# EasyEDA schematic EasyEDA_SCH_alexo_2026-07-04.json
TITLE: Circuito elettrico ALEXO - Assistente vocale; REV: 1.1; Date: 2026-06-28; Sheet: 1/1; Company: Peppe Minniti
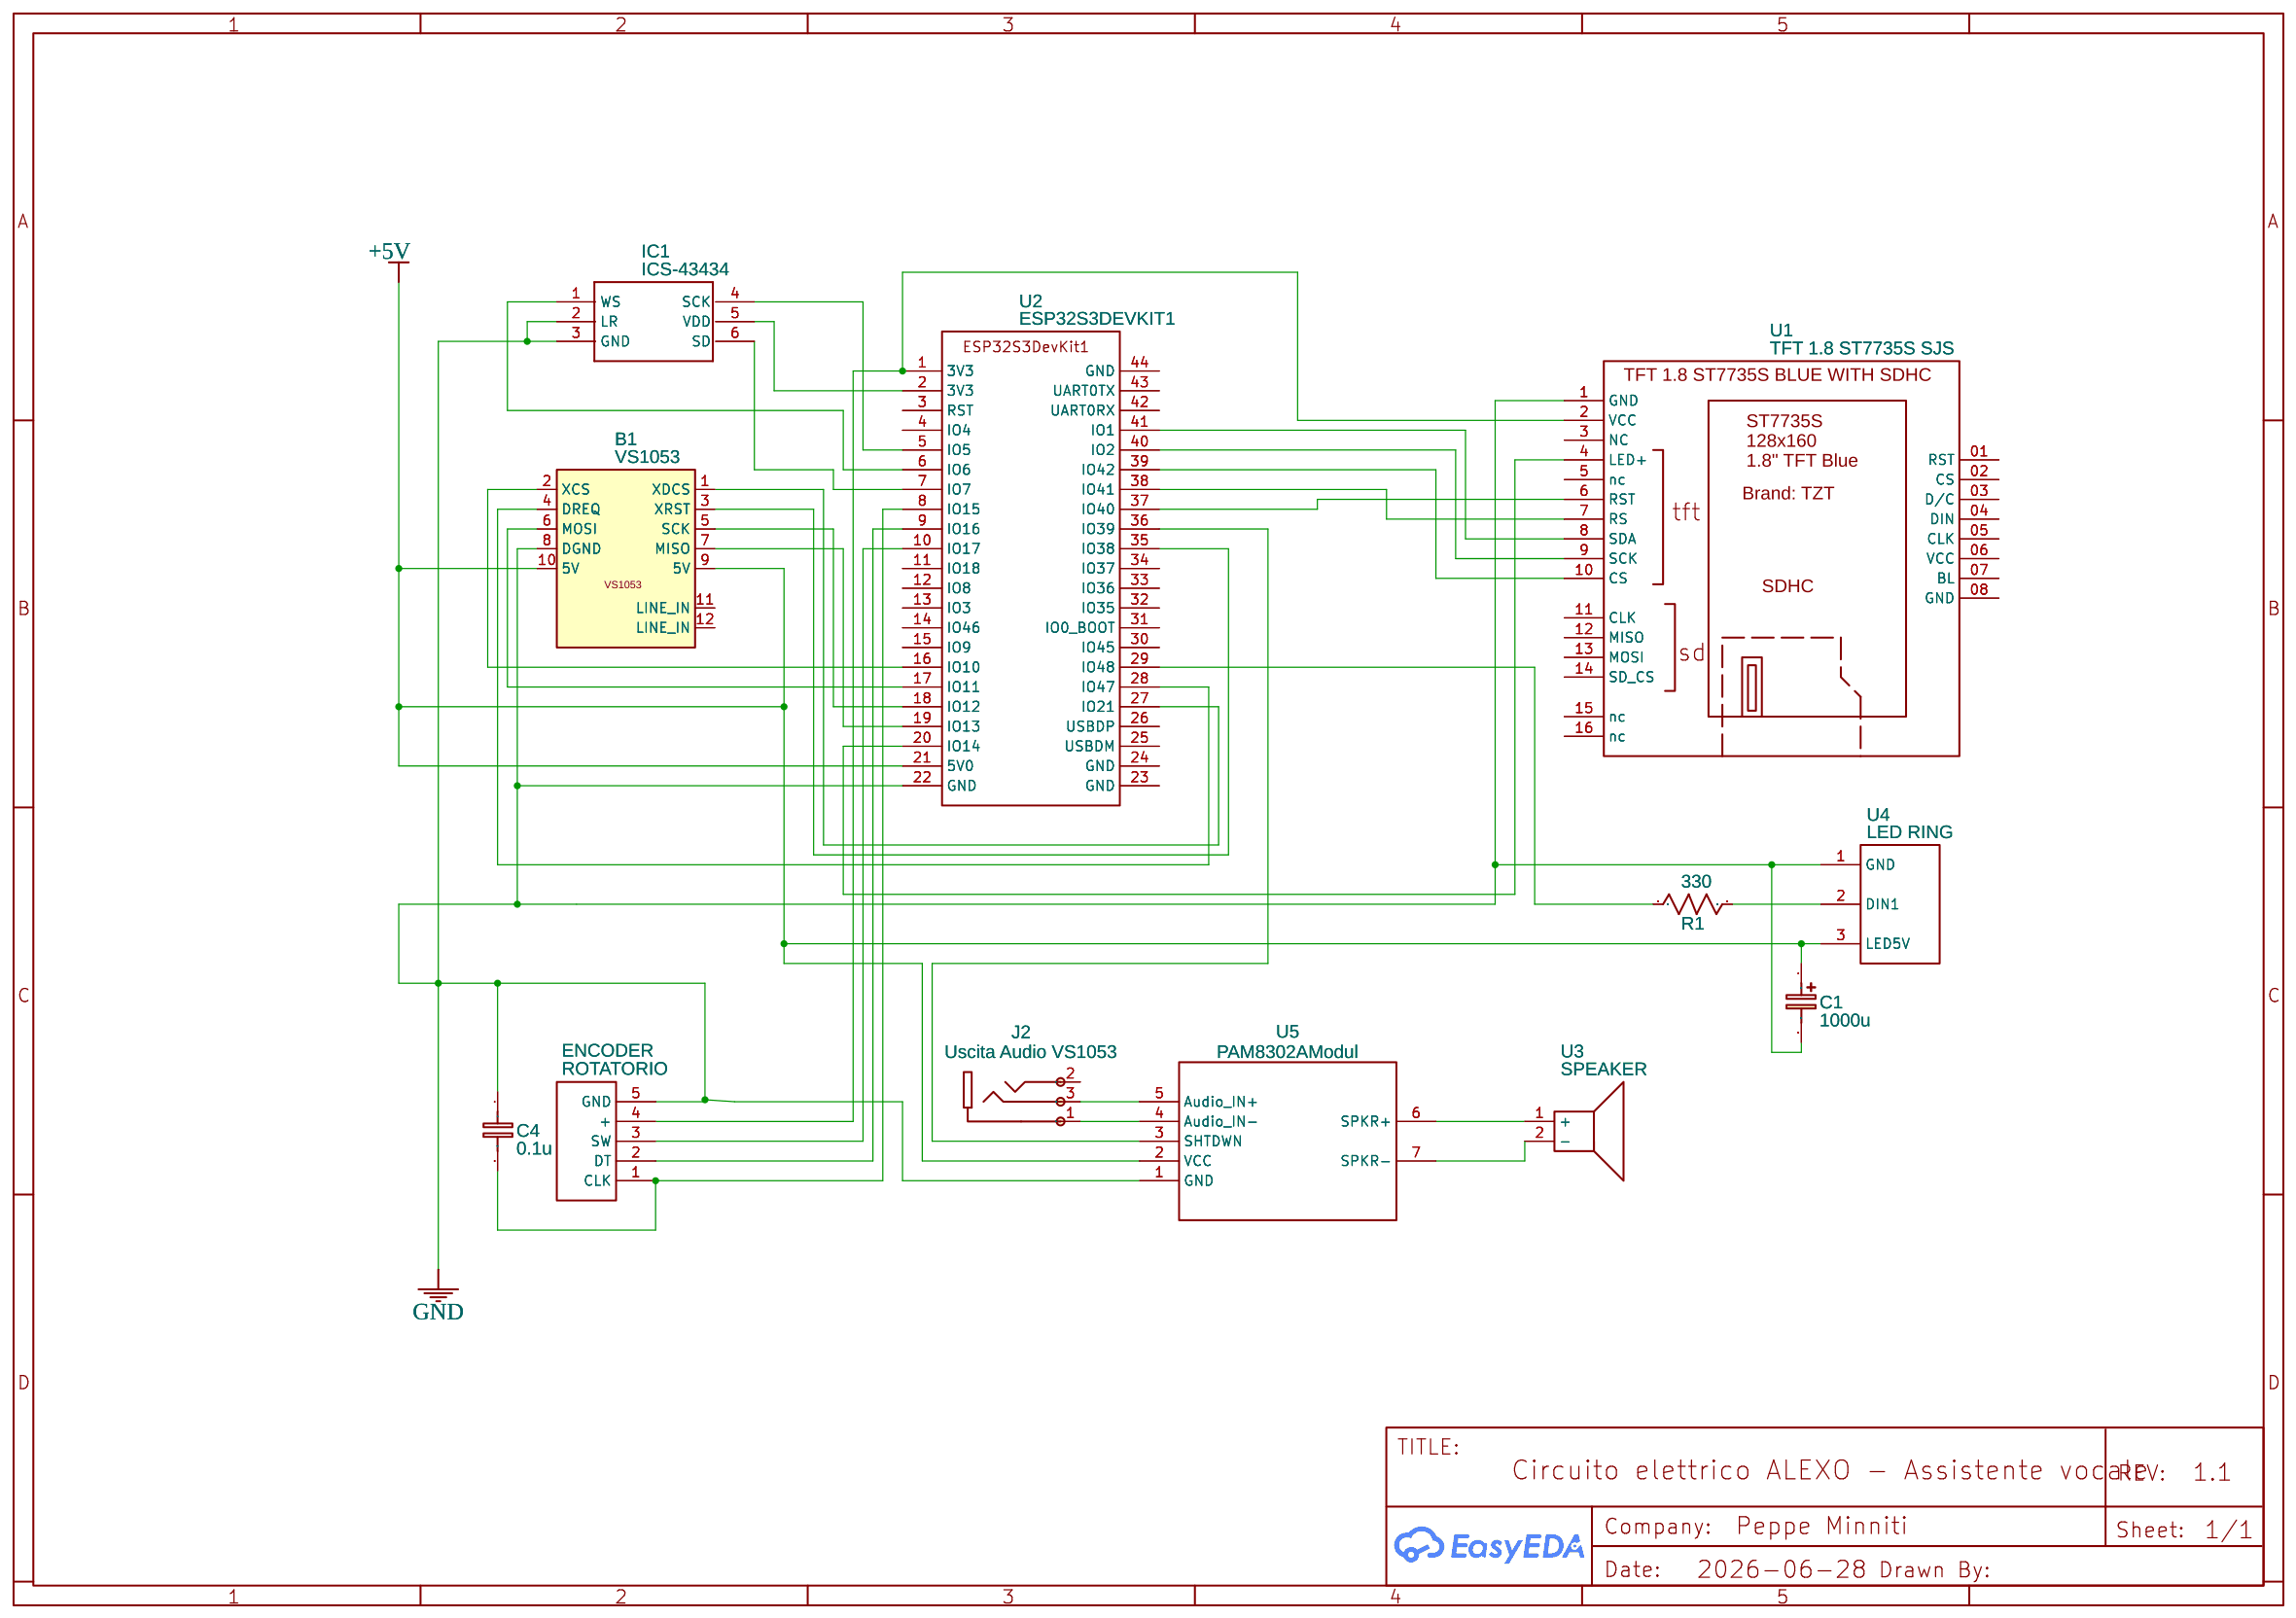
[diagram p0: schematic sheet]

## Parts
B1  VS1053  [VS1053]
C1  1000u  [CASE-A_3216]
C4  0.1u  [C0603]
ENCODER  ROTATORIO  [ROTARYENCODER]
IC1  ICS-43434  [ICS43434]
J2  Uscita Audio VS1053  [AUDIO-SMD_PJ-320B]
R1  330  [R0603]
U1  TFT 1.8 ST7735S SJS  [TFT1.8_128X160_SPI_ST7735S_BLUE_SDHC (TZT)]
U2  ESP32S3DEVKIT1  [ESP32S3DEVKIT1]
U3  SPEAKER  [SPEAKER]
U4  LED RING  [LED RING]
U5  PAM8302AModul  [PAM8302AMODUL]

## Library data of the parts
B1 = VS1053: Contributor: horneczki
C1 = C_Tan_SMD_A_EU: Contributor: LCEDA_Lib
C4 = C_0603_EU: Contributor: LCEDA_Lib
ENCODER = ROTARY ENCODER (BREAKOUT): Contributor: avasa05
IC1 = ICS-43434: Contributor: Moritz
J2 = 320B/PJ-0013.5JACKS: Contributor: LCSC; Supplier: LCSC; Supplier Part: C9900004395; Manufacturer Part: 320B/PJ-0013.5Jacks; Manufacturer: null; JLCPCB Part Class: Extended Part
R1 = R_0603_US: Contributor: LCEDA_Lib
U1 = TFT 1.8 ST7735S SJS: Contributor: Bart Huyskens; link: https://aliexpress.ru/item/4000016800528.html?spm=a2g0o.cart.0.0.4f433c00Ax6HiP&mp=1&_ga=2.17494385.919993428.1620242266-980980248.1605027243&_gac=1.23599176.1617129431.Cj0KCQjwmIuDBhDXARIsAFITC_6FgPL5eIhgJ2Nk2ytLiy_ESinqYYuMc7DqpmCa8XDG0hFUPvitq-saAq1zEALw_wcB
U2 = ESP32S3DEVKIT1 COPY: Manufacturer Part: ESP32S3DevKit1; Contributor: aas.haifa
U3 = SPEAKER COPY: Contributor: Thomas Feyen
U4 = LED RING: Contributor: afgasgasdg
U5 = PAM8302AModul: Contributor: dochagen

## Nets
+5V: B1.9(5V) B1.10(5V) C1.1 U2.21(5V0) U4.3(LED5V) U5.2(VCC)
GND: B1.8(DGND) C1.2 C4.1 ENCODER.5(GND) IC1.2(LR) IC1.3(GND) U1.1(GND) U2.22(GND) U4.1(GND) U5.1(GND)
Net-(B1-1): B1.1(XDCS) U2.27(IO21)
Net-(B1-2): B1.2(XCS) U2.16(IO10)
Net-(B1-3): B1.3(XRST) U2.35(IO38)
Net-(B1-4): B1.4(DREQ) U2.28(IO47)
Net-(B1-5): B1.5(SCK) U2.18(IO12)
Net-(B1-6): B1.6(MOSI) U2.17(IO11)
Net-(B1-7): B1.7(MISO) U2.19(IO13)
Net-(C4-2): C4.2 ENCODER.1(CLK) U2.8(IO15)
Net-(ENCODER-2): ENCODER.2(DT) U2.9(IO16)
Net-(ENCODER-3): ENCODER.3(SW) U2.10(IO17)
Net-(ENCODER-4): ENCODER.4(+) U1.2(VCC) U2.1(3V3)
Net-(IC1-1): IC1.1(WS) U2.6(IO6)
Net-(IC1-4): IC1.4(SCK) U2.5(IO5)
Net-(IC1-5): IC1.5(VDD) U2.2(3V3)
Net-(IC1-6): IC1.6(SD) U2.7(IO7)
Net-(J2-1): J2.1 U5.4(Audio IN-)
Net-(J2-3): J2.3 U5.5(Audio IN+)
Net-(R1-1): R1.1 U2.29(IO48)
Net-(R1-2): R1.2 U4.2(DIN1)
Net-(U1-4): U1.4(LED+) U2.20(IO14)
Net-(U1-6): U1.6(RST) U2.37(IO40)
Net-(U1-7): U1.7(RS) U2.38(IO41)
Net-(U1-8): U1.8(SDA) U2.41(IO1)
Net-(U1-9): U1.9(SCK) U2.40(IO2)
Net-(U1-10): U1.10(CS) U2.39(IO42)
Net-(U2-36): U2.36(IO39) U5.3(SHTDWN)
Net-(U3-1): U3.1(+) U5.6(SPKR+)
Net-(U3-2): U3.2(-) U5.7(SPKR-)

Not connected (* = marked no-connect by the designer): B1 11(LINE IN) 12(LINE IN); J2 2; U1 01(RST) 02(CS) 3(NC) 03(D/C) 04(DIN) 5(nc) 05(CLK) 06(VCC) 07(BL) 08(GND) 11(CLK) 12(MISO) 13(MOSI) 14(SD_CS) 15(nc) 16(nc); U2 3(RST) 4(IO4) 11(IO18) 12(IO8) 13(IO3) 14(IO46) 15(IO9) 23(GND) 24(GND) 25(USBDM) 26(USBDP) 30(IO45) 31(IO0_BOOT) 32(IO35) 33(IO36) 34(IO37) 42(UART0RX) 43(UART0TX) 44(GND)
